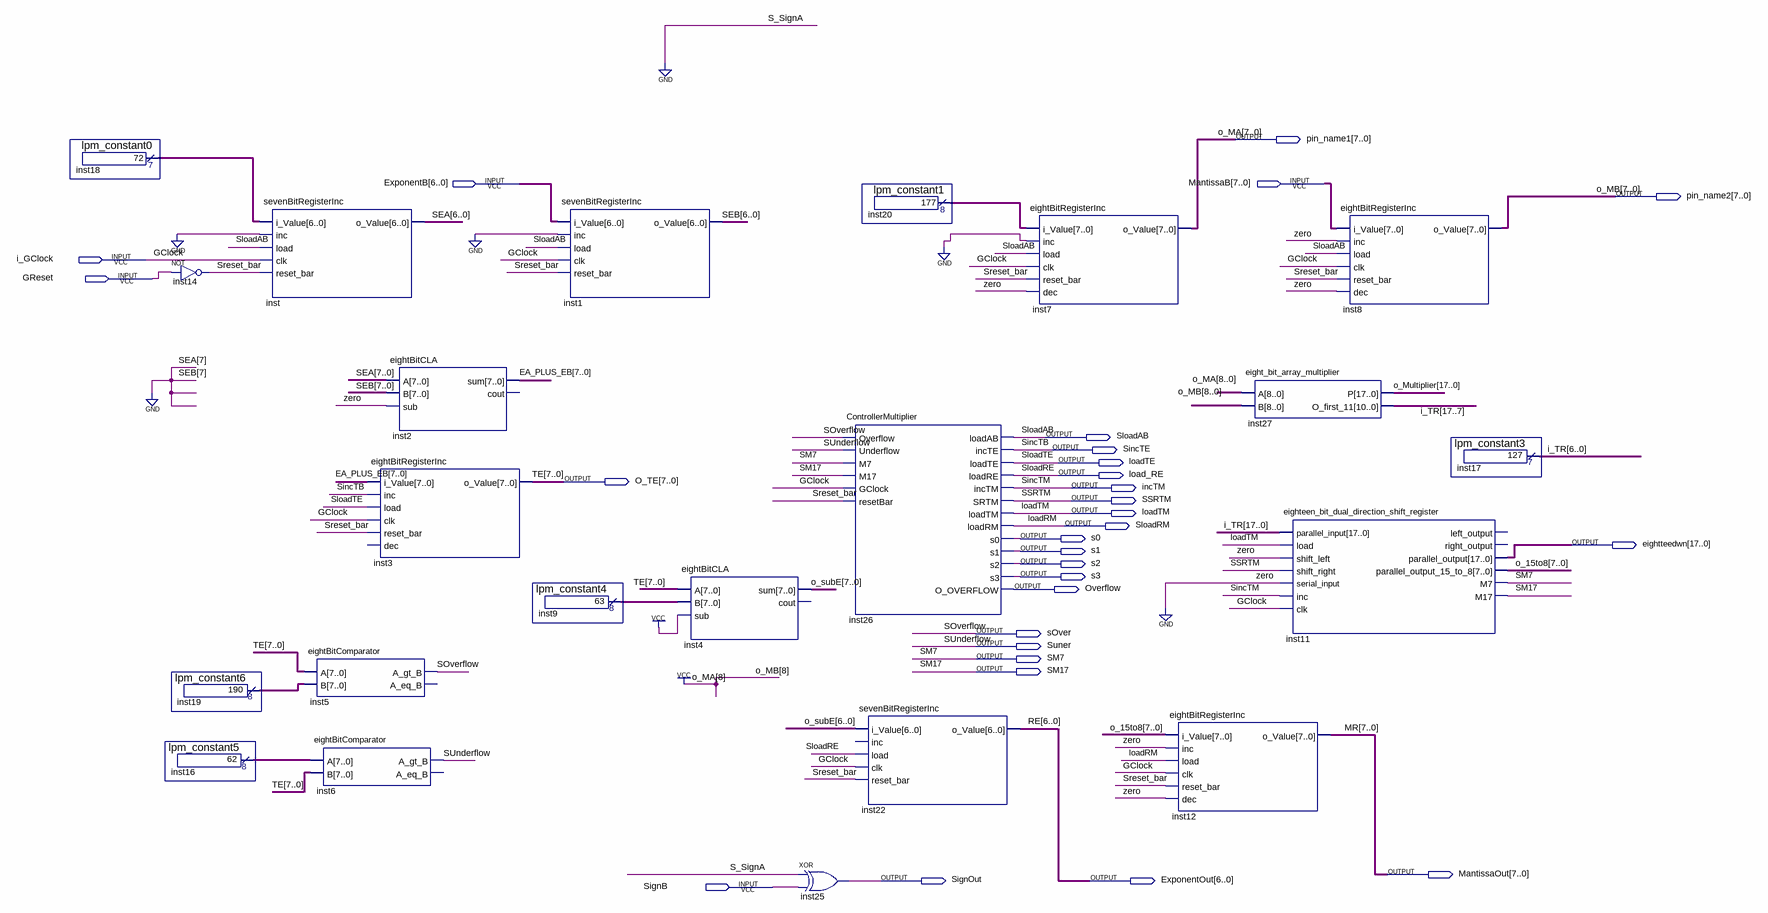
[diagram p0: schematic sheet]
// Quartus schematic Multiplier.bdf as structural Verilog: 22 symbols, 29 pins
module Multiplier (
  input  [6:0] ExponentB,
  input  [7:0] MantissaB,
  input  i_GClock,
  input  GReset,
  input  SignB,
  output [7:0] pin_name1,
  output [7:0] pin_name2,
  output SloadAB,
  output SincTE,
  output loadTE,
  output load_RE,
  output [7:0] O_TE,
  output incTM,
  output SSRTM,
  output loadTM,
  output SloadRM,
  output s0,
  output [17:0] eightteedwn,
  output s1,
  output s2,
  output s3,
  output Overflow,
  output sOver,
  output Suner,
  output SM7,
  output SM17,
  output [7:0] MantissaOut,
  output SignOut,
  output [6:0] ExponentOut
);

  wire Sreset_bar;
  wire [6:0] inst18_result, SEA, SEB;
  wire [7:0] EA_PLUS_EB, inst9_result, inst16_result, inst19_result, inst20_result, o_15to8, o_subE;
  wire [17:0] i_TR, o_Multiplier;

  lpm_constant0 inst18 (.result(inst18_result));
  not inst14 (Sreset_bar, GReset);
  lpm_constant6 inst19 (.result(inst19_result));
  lpm_constant5 inst16 (.result(inst16_result));
  sevenBitRegisterInc inst (
    .i_Value(inst18_result), .inc(1'b0), .load(SloadAB), .clk(i_GClock), .reset_bar(Sreset_bar), .o_Value(SEA));
  eightBitComparator inst5 (.A(O_TE), .B(inst19_result), .A_gt_B(sOver));  // open: A_eq_B
  eightBitComparator inst6 (.A(inst16_result), .B(O_TE), .A_gt_B(Suner));  // open: A_eq_B
  eightBitCLA inst2 (.A({1'b0, SEA}), .B({1'b0, SEB}), .sub(1'b0), .sum(EA_PLUS_EB));  // open: cout
  eightBitRegisterInc inst3 (
    .i_Value(EA_PLUS_EB), .inc(SincTE), .load(loadTE), .clk(i_GClock), .reset_bar(Sreset_bar), .o_Value(O_TE));  // open: dec
  lpm_constant4 inst9 (.result(inst9_result));
  sevenBitRegisterInc inst1 (
    .i_Value(ExponentB), .inc(1'b0), .load(SloadAB), .clk(i_GClock), .reset_bar(Sreset_bar), .o_Value(SEB));
  eightBitCLA inst4 (.A(O_TE), .B(inst9_result), .sub(1'b1), .sum(o_subE));  // open: cout
  xor inst25 (SignOut, 1'b0, SignB);
  ControllerMultiplier inst26 (
    .Overflow(sOver), .Underflow(Suner), .M7(SM7), .M17(SM17), .GClock(i_GClock), .resetBar(Sreset_bar),
    .loadAB(SloadAB), .incTE(SincTE), .loadTE(loadTE), .loadRE(load_RE), .incTM(incTM), .SRTM(SSRTM),
    .loadTM(loadTM), .loadRM(SloadRM), .s0(s0), .s1(s1), .s2(s2), .s3(s3), .O_OVERFLOW(Overflow));
  sevenBitRegisterInc inst22 (
    .i_Value(o_subE[6:0]), .load(load_RE), .clk(i_GClock), .reset_bar(Sreset_bar), .o_Value(ExponentOut));  // open: inc
  lpm_constant1 inst20 (.result(inst20_result));
  eightBitRegisterInc inst7 (
    .i_Value(inst20_result), .inc(1'b0), .load(SloadAB), .clk(i_GClock), .reset_bar(Sreset_bar), .dec(1'b0),
    .o_Value(pin_name1));
  eightBitRegisterInc inst12 (
    .i_Value(o_15to8), .inc(1'b0), .load(SloadRM), .clk(i_GClock), .reset_bar(Sreset_bar), .dec(1'b0),
    .o_Value(MantissaOut));
  eight_bit_array_multiplier inst27 (
    .A({1'b1, pin_name1}), .B({1'b1, pin_name2}), .P(o_Multiplier), .O_first_11(i_TR[17:7]));
  eighteen_bit_dual_direction_shift_register inst11 (
    .parallel_input(i_TR), .load(loadTM), .shift_left(1'b0), .shift_right(SSRTM), .serial_input(1'b0),
    .inc(incTM), .clk(i_GClock), .parallel_output(eightteedwn), .parallel_output_15_to_8(o_15to8), .M7(SM7),
    .M17(SM17));  // open: left_output, right_output
  eightBitRegisterInc inst8 (
    .i_Value(MantissaB), .inc(1'b0), .load(SloadAB), .clk(i_GClock), .reset_bar(Sreset_bar), .dec(1'b0),
    .o_Value(pin_name2));
  lpm_constant3 inst17 (.result(i_TR[6:0]));

  // Other names for the same wires on the sheet: GClock = i_GClock; loadRM = SloadRM; MR[7:0] = MantissaOut;
  //   o_MA[7:0] = pin_name1; o_MB[7:0] = pin_name2; RE[6:0] = ExponentOut; SincTB = SincTE; SincTM = incTM;
  //   SloadRE = load_RE; SloadTE = loadTE; SOverflow = sOver; SUnderflow = Suner; TE[7:0] = O_TE
endmodule
